# EAGLE design imu (EAGLE 9.5.0)
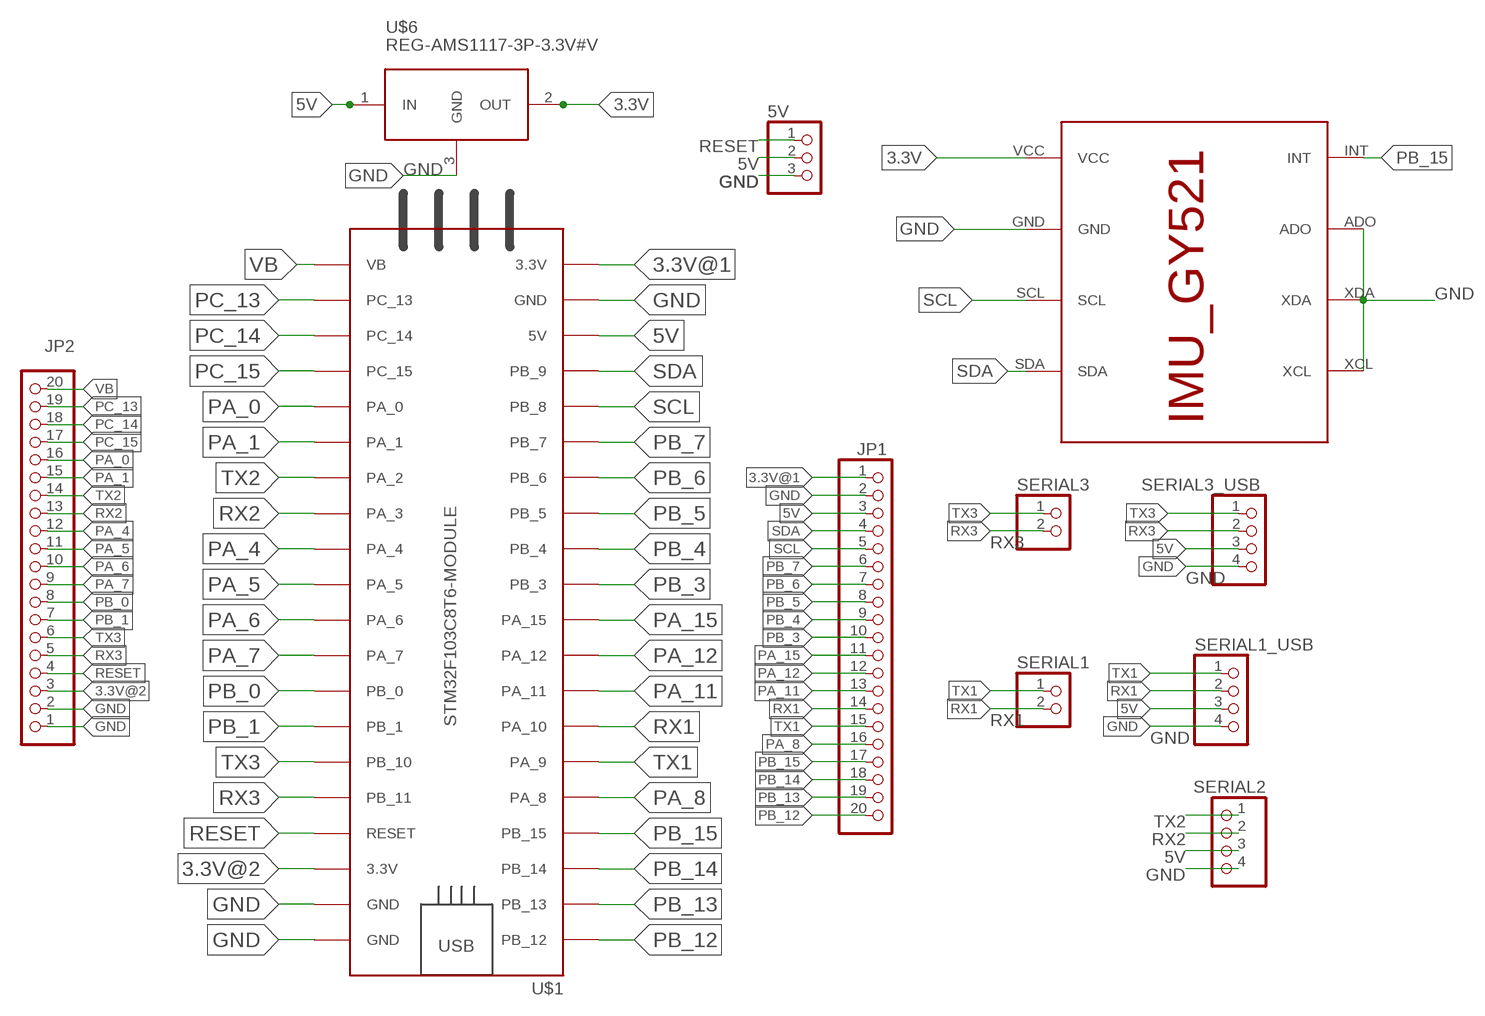
[diagram p0: schematic, sheet 1]

## Parts
5V  PINHD-3_DATA  [1X03_DATA]
JP1  PINHD-1X20  [1X20]
JP2  PINHD-1X20  [1X20]
SERIAL1  PINHD-2_DATA  [1X02_DATA]
SERIAL1_USB  PINHD-4_DATA  [1X04_DATA]
SERIAL2  PINHD-4_DATA  [1X04_DATA]
SERIAL3  PINHD-2_DATA  [1X02_DATA]
SERIAL3_USB  PINHD-4_DATA  [1X04_DATA]
U$1  STM32F103C8T6-MODULE  [STM32F103C8T6-MODULE]
U$2  IMU_ROBOCON_GY521  [IMU_GY521]
U$6  REG-AMS1117-3P-3.3V#V  [REG-AMS1117-3P#V]

## Nets
3.3V: U$2.VCC U$6.2(OUT)
3.3V@1: JP1.1 U$1.3.3V_1(3.3V)
3.3V@2: JP2.3 U$1.3.3V_2(3.3V)
5V: 5V.2 JP1.3 SERIAL1_USB.3 SERIAL2.3 SERIAL3_USB.3 U$1.5V U$6.1(IN)
GND: 5V.3 JP1.2 JP2.1 JP2.2 SERIAL1_USB.4 SERIAL2.4 SERIAL3_USB.4 U$1.GND_1(GND) U$1.GND_2(GND) U$1.GND_3(GND) U$2.ADO U$2.GND U$2.XCL U$2.XDA U$6.3(GND)
PA_0: JP2.16 U$1.PA_0
PA_1: JP2.15 U$1.PA_1
PA_4: JP2.12 U$1.PA_4
PA_5: JP2.11 U$1.PA_5
PA_6: JP2.10 U$1.PA_6
PA_7: JP2.9 U$1.PA_7
PA_8: JP1.16 U$1.PA_8
PA_11: JP1.13 U$1.PA_11
PA_12: JP1.12 U$1.PA_12
PA_15: JP1.11 U$1.PA_15
PB_0: JP2.8 U$1.PB_0
PB_1: JP2.7 U$1.PB_1
PB_3: JP1.10 U$1.PB_3
PB_4: JP1.9 U$1.PB_4
PB_5: JP1.8 U$1.PB_5
PB_6: JP1.7 U$1.PB_6
PB_7: JP1.6 U$1.PB_7
PB_12: JP1.20 U$1.PB_12
PB_13: JP1.19 U$1.PB_13
PB_14: JP1.18 U$1.PB_14
PB_15: JP1.17 U$1.PB_15 U$2.INT
PC_13: JP2.19 U$1.PC_13
PC_14: JP2.18 U$1.PC_14
PC_15: JP2.17 U$1.PC_15
RESET: 5V.1 JP2.4 U$1.RESET
RX1: JP1.14 SERIAL1.2 SERIAL1_USB.2 U$1.PA_10
RX2: JP2.13 SERIAL2.2 U$1.PA_3
RX3: JP2.5 SERIAL3.2 SERIAL3_USB.2 U$1.PB_11
SCL: JP1.5 U$1.PB_8 U$2.SCL
SDA: JP1.4 U$1.PB_9 U$2.SDA
TX1: JP1.15 SERIAL1.1 SERIAL1_USB.1 U$1.PA_9
TX2: JP2.14 SERIAL2.1 U$1.PA_2
TX3: JP2.6 SERIAL3.1 SERIAL3_USB.1 U$1.PB_10
VB: JP2.20 U$1.VB

## Library data of the parts
5V = MIA_LIBRARY-2-2-2:PINHD-3_DATA: PIN HEADER
JP1 JP2 = MIA_LIBRARY-2-2-2:PINHD-1X20: PIN HEADER
SERIAL1 SERIAL3 = MIA_LIBRARY-2-2-2:PINHD-2_DATA: PIN HEADER
SERIAL1_USB SERIAL2 SERIAL3_USB = MIA_LIBRARY-2-2-2:PINHD-4_DATA: PIN HEADER
U$1 = MIA_LIBRARY-2-2-2:STM32F103C8T6-MODULE: STM32F103C8T6 module with ARM Cortex-3, 20kB SRAM, 64kB Flash, 72MHz
U$2 = MIA_LIBRARY-2-2-2:IMU_ROBOCON_GY521
U$6 = MIA_LIBRARY-2-2-2:REG-AMS1117-3P-*: Linear Regulator based on AMS1117 chip 3-pin version AMS1117 datasheet is available here: http://www.advanced-monolithic.com/pdf/ds1117.pdf Click here to find device on ebay.com <http://www.ebay.com/sch/ams1117+module> Note: There are many variants. Search for the proper version.

## Board
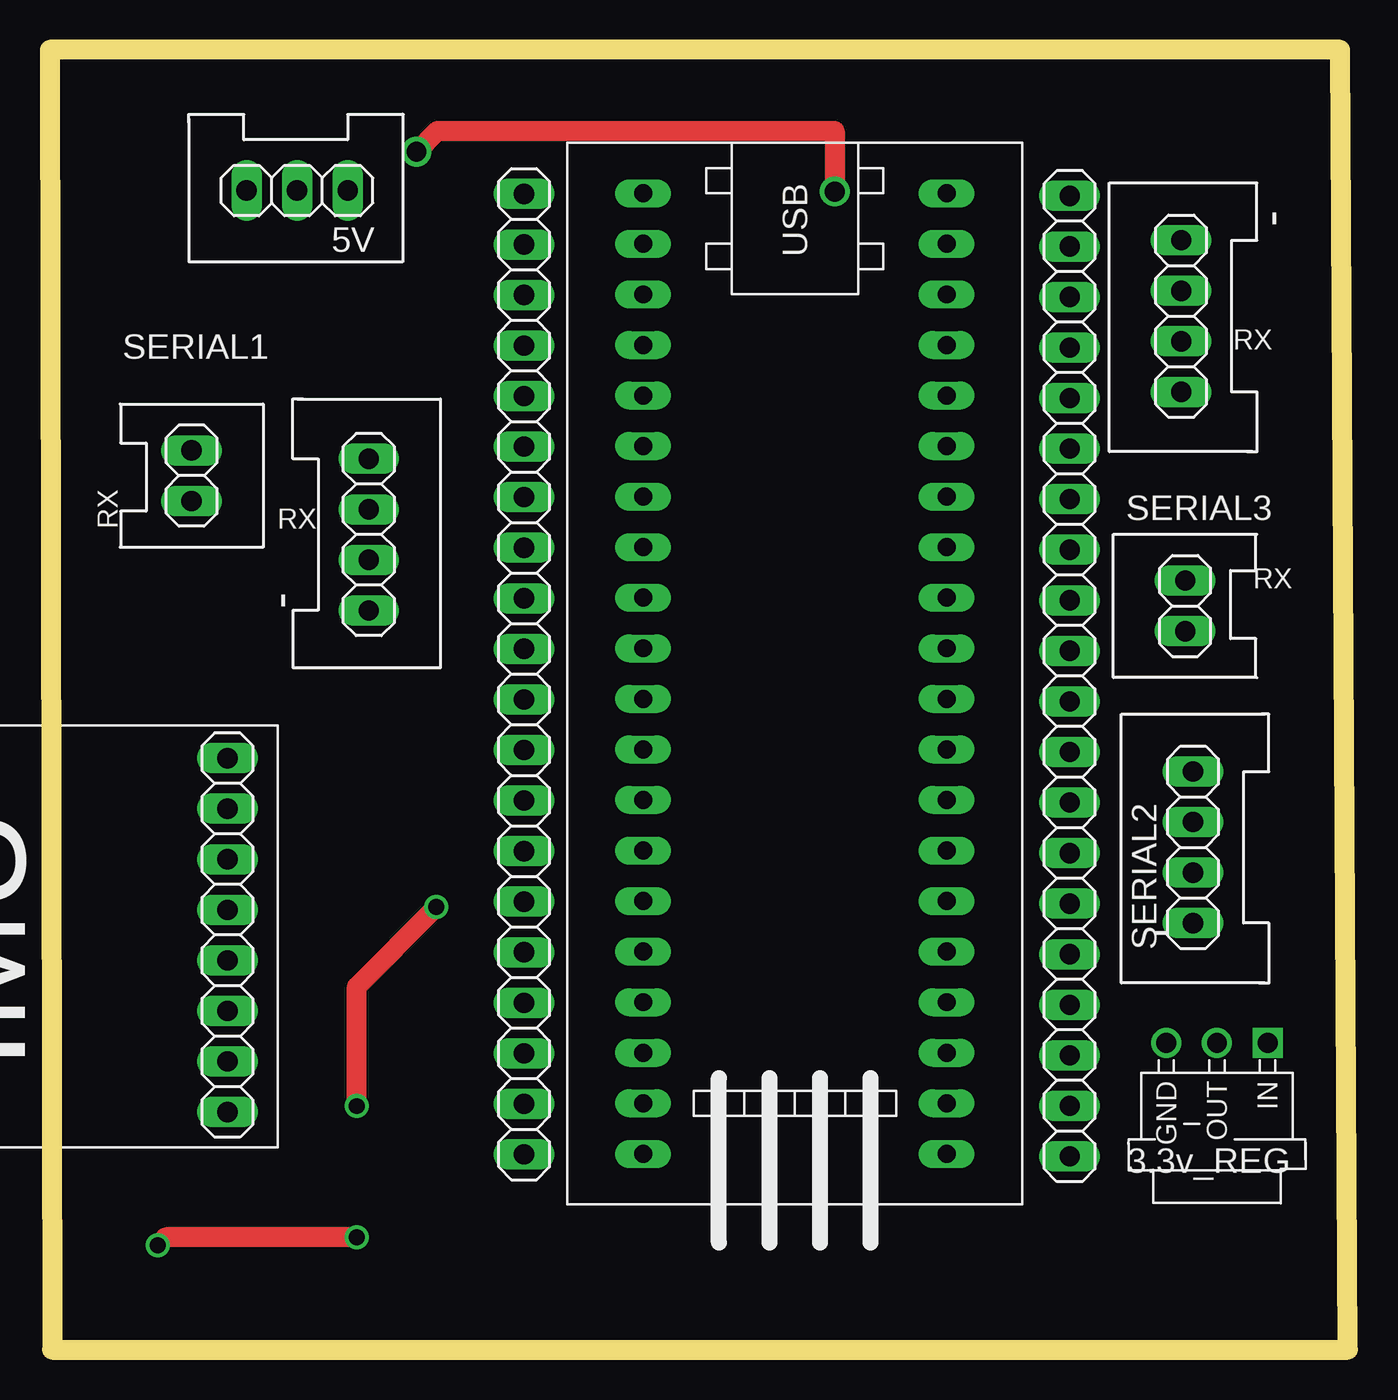
[diagram p1: board, top side]
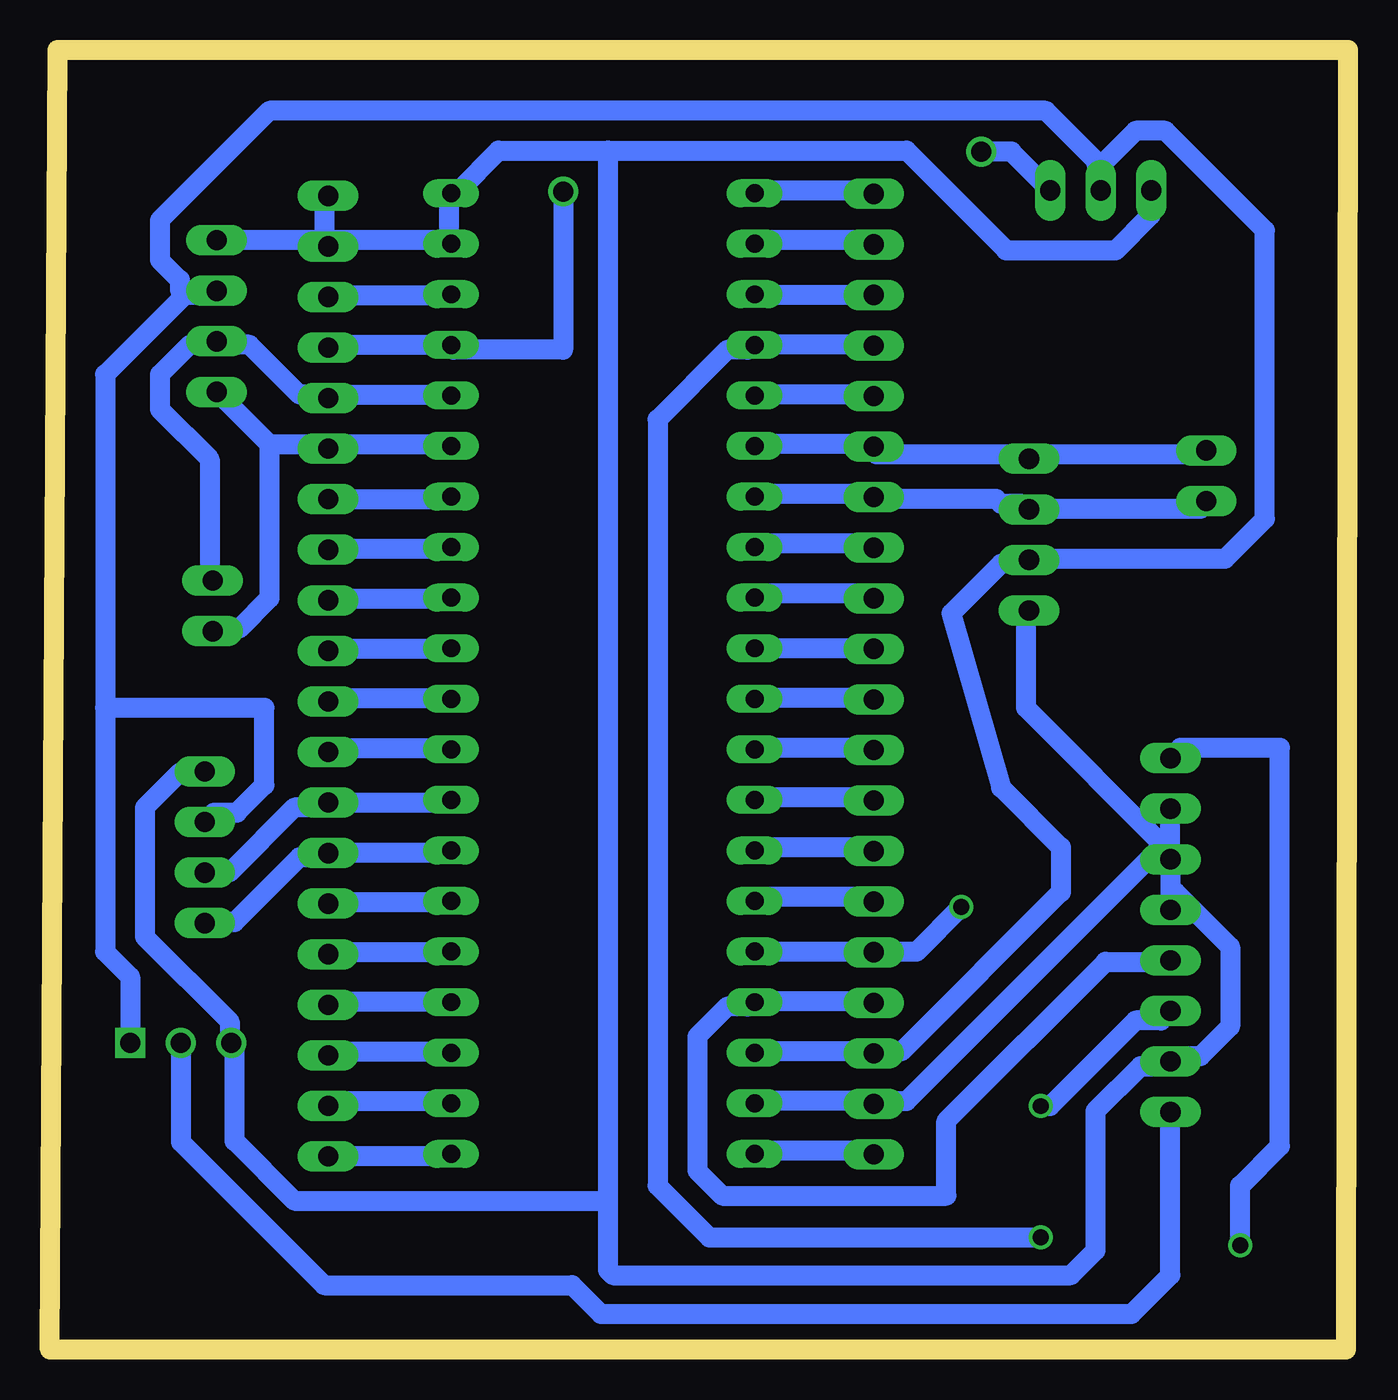
[diagram p2: board, bottom side, seen from below]

Size 65.2 x 65.31 mm. Coordinates in mm from the lower left corner, seen from the top.
Outline: 0.11,0 65.2,0 64.8,65.31 0,65.31 0.11,0
Copper layers (1*16): Top 0.035mm / dielectric 1.5mm / Bottom 0.035mm
Design rules "default *": minimum track width 1mm, minimum drill 0.35mm, track to track 0.8mm, track to pad 0.8mm, pad to pad 0.8mm, via to via 0.8mm, smd to smd 6mil, copper to edge 0.8mm, drill to drill 0.8mm, minimum pad ring 10mil, minimum via ring 8mil, stop-mask expansion 4mil, vias tented up to drill 0mil, thermal gap 10mil

### Footprints (pad centres in the part's own frame; a part is rotated, then mirrored left to right if it is on the bottom)
1X03_DATA = drill 1.016 long: 1 -2.54,0; 2 0,0; 3 2.54,0
1X20 = drill 1.016 long: 1 -24.13,0; 2 -21.59,0; 3 -19.05,0; 4 -16.51,0; 5 -13.97,0; 6 -11.43,0; 7 -8.89,0; 8 -6.35,0; 9 -3.81,0; 10 -1.27,0; 11 1.27,0; 12 3.81,0; 13 6.35,0; 14 8.89,0; 15 11.43,0; 16 13.97,0; 17 16.51,0; 18 19.05,0; 19 21.59,0; 20 24.13,0
1X02_DATA = drill 1.016 long: 1 -1.27,0; 2 1.27,0
1X04_DATA = drill 1.016 long: 1 -3.81,0; 2 -1.27,0; 3 1.27,0; 4 3.81,0
STM32F103C8T6-MODULE = drill 0.9 long: 3.3V_1 25.4,-7.62; 3.3V_2 -17.78,7.62; 5V 20.32,-7.62; GND_1 22.86,-7.62; GND_2 -20.32,7.62; GND_3 -22.86,7.62; PA_0 15.24,7.62; PA_1 12.7,7.62; PA_2 10.16,7.62; PA_3 7.62,7.62; PA_4 5.08,7.62; PA_5 2.54,7.62; PA_6 0,7.62; PA_7 -2.54,7.62; PA_8 -12.7,-7.62; PA_9 -10.16,-7.62; PA_10 -7.62,-7.62; PA_11 -5.08,-7.62; PA_12 -2.54,-7.62; PA_15 0,-7.62; PB_0 -5.08,7.62; PB_1 -7.62,7.62; PB_3 2.54,-7.62; PB_4 5.08,-7.62; PB_5 7.62,-7.62; PB_6 10.16,-7.62; PB_7 12.7,-7.62; PB_8 15.24,-7.62; PB_9 17.78,-7.62; PB_10 -10.16,7.62; PB_11 -12.7,7.62; PB_12 -22.86,-7.62; PB_13 -20.32,-7.62; PB_14 -17.78,-7.62; PB_15 -15.24,-7.62; PC_13 22.86,7.62; PC_14 20.32,7.62; PC_15 17.78,7.62; RESET -15.24,7.62; VB 25.4,7.62
IMU_GY521 = drill 1.016 long: ADO -6.35,0; GND 6.35,0; INT -8.89,0; SCL 3.81,0; SDA 1.27,0; VCC 8.89,0; XCL -3.81,0; XDA -1.27,0
REG-AMS1117-3P#V = drill 1 square: 1 -2.54,-5.08 | drill 1: 2 0,-5.08; 3 2.54,-5.08

### Placement (x,y rotation side)
5V  12.42,58.24 180 top
JP1  23.82,33.94 90 top
JP2  51.22,33.84 270 top
SERIAL1  7.12,43.91 270 top
SERIAL1_USB  16.02,40.95 270 top
SERIAL2  57.42,25.24 90 top
SERIAL3  57.02,37.37 90 top
SERIAL3_USB  56.82,51.93 90 top
U$1  37.42,35.24 270 top
U$2  8.92,20.83 270 top
U$6  58.62,10.34 180 top

### Tracks (layer width: path | path; a pad name or v marks a point on that pad's centre or on a via)
3.3V
  Bottom 1: U$6.2 58.62,10.44 51.42,3.24 38.97,3.24 37.52,1.8 10.86,1.8 8.92,3.74 U$2.VCC
3.3V@1
  Bottom 1: U$1.3.3V_1 29.67,9.99 23.92,9.99 JP1.1
3.3V@2
  Bottom 1: U$1.3.3V_2 45.17,52.99 51.17,52.99 JP2.3
5V
  Bottom 1: 62.42,32.24 62.42,48.99 58.42,52.99 | 62.42,32.24 62.42,19.99 61.17,18.74 61.17,15.49 U$6.1 | 58.42,52.99 56.92,52.99 SERIAL3_USB.3 | U$1.5V 29.67,14.99 23.92,14.99 JP1.3 23.42,14.99 22.42,14.99 14.42,22.99 14.42,25.24 17.42,28.24 19.92,36.99 17.42,39.49 16.42,39.49 SERIAL1_USB.3 15.92,39.74 6.17,39.74 4.17,41.74 4.17,56.24 9.17,61.24 10.67,61.24 12.42,59.49 5V.2 12.67,59.74 15.17,62.24 54.17,62.24 59.67,56.74 59.67,54.74 58.67,53.74 58.67,53.24 58.42,52.99 | SERIAL2.3 56.94,26.99 55.8,26.99 54.42,28.37 54.42,32.24 62.42,32.24
GND
  Bottom 1: SERIAL1_USB.4 16.17,36.99 16.17,32.24 9.17,25.24 U$2.XCL | U$1.GND_1 29.67,12.49 23.92,12.49 JP1.2 23.42,12.49 22.17,12.49 9.42,25.24 U$2.XCL | SERIAL2.4 57.42,28.99 58.67,28.99 60.42,27.24 60.42,20.74 56.17,16.49 56.17,15.49 U$6.3 55.92,14.99 55.92,10.49 52.92,7.49 37.42,7.49 37.17,7.24 | JP2.2 51.42,55.49 51.42,57.74 JP2.1 | SERIAL3_USB.4 51.67,55.74 JP2.2 | 37.17,60.24 42.67,60.24 44.67,58.24 U$1.GND_3 45.17,57.99 45.17,55.74 U$1.GND_2 45.67,55.74 50.92,55.74 JP2.2 | 37.17,60.24 22.17,60.24 17.17,55.24 11.67,55.24 9.92,56.99 9.92,58.24 5V.3 | 37.17,60.24 37.17,7.24 | 37.17,7.24 37.17,3.99 36.92,3.74 13.92,3.74 12.67,4.99 12.67,11.99 10.42,14.24 8.92,14.24 U$2.GND 8.67,14.74 7.42,14.74 5.92,16.24 5.92,20.24 8.67,22.99 8.92,22.99 | U$2.XCL 8.92,22.99 | 8.92,22.99 U$2.XDA | U$2.XCL U$2.ADO
PA_0
  Bottom 1: U$1.PA_0 45.17,19.99 51.17,19.99 JP2.16
PA_1
  Bottom 1: U$1.PA_1 45.17,22.49 51.17,22.49 JP2.15
PA_4
  Bottom 1: U$1.PA_4 45.17,30.24 51.17,30.24 JP2.12
PA_5
  Bottom 1: U$1.PA_5 45.17,32.74 51.17,32.74 JP2.11
PA_6
  Bottom 1: U$1.PA_6 51.17,35.24 JP2.10
PA_7
  Bottom 1: U$1.PA_7 45.17,37.74 51.17,37.74 JP2.9
PA_8
  Bottom 1: U$1.PA_8 29.67,47.99 23.92,47.99 JP1.16
PA_11
  Bottom 1: U$1.PA_11 29.67,40.49 23.92,40.49 JP1.13
PA_12
  Bottom 1: U$1.PA_12 29.67,37.99 23.92,37.99 JP1.12
PA_15
  Bottom 1: U$1.PA_15 23.92,35.24 JP1.11
PB_0
  Bottom 1: U$1.PB_0 45.17,40.24 51.17,40.24 JP2.8
PB_1
  Bottom 1: U$1.PB_1 45.17,42.74 51.17,42.74 JP2.7
PB_3
  Bottom 1: U$1.PB_3 29.67,32.74 23.92,32.74 JP1.10
PB_4
  Bottom 1: U$1.PB_4 29.67,30.24 23.92,30.24 JP1.9
PB_5
  Bottom 1: U$1.PB_5 29.67,27.74 23.92,27.74 JP1.8
PB_6
  Bottom 1: U$1.PB_6 29.67,25.24 23.92,25.24 JP1.7
PB_7
  Bottom 1: U$1.PB_7 29.67,22.74 23.92,22.74 JP1.6
PB_12
  Bottom 1: U$1.PB_12 29.67,58.24 23.92,58.24 JP1.20
PB_13
  Bottom 1: U$1.PB_13 29.67,55.74 23.92,55.74 JP1.19
PB_14
  Bottom 1: JP1.18 29.67,52.99 U$1.PB_14
PB_15  (via drill 0.8)
  Top 1: v15.42,5.64 5.82,5.64 v5.42,5.24
  Bottom 1: JP1.17 23.92,50.49 29.67,50.49 U$1.PB_15 30.17,50.24 31.17,50.24 34.67,46.74 34.67,8.24 32.07,5.64 v15.42,5.64 | v5.42,5.24 5.42,8.24 3.42,10.24 3.42,30.24 8.4,30.24 U$2.INT
PC_13
  Bottom 1: U$1.PC_13 45.17,12.49 51.17,12.49 JP2.19
PC_14
  Bottom 1: U$1.PC_14 45.17,14.99 51.17,14.99 JP2.18
PC_15
  Bottom 1: U$1.PC_15 45.17,17.49 51.17,17.49 JP2.17
RESET  (via drill 1)
  Top 1: v18.42,60.19 19.47,61.24 39.42,61.24 v39.42,58.19
  Bottom 1: 45.17,50.49 51.17,50.49 JP2.4 | 45.17,50.49 U$1.RESET | 5V.1 16.91,60.19 v18.42,60.19 | v39.42,58.19 39.42,50.24 44.92,50.24 45.17,50.49
RX1
  Bottom 1: U$1.PA_10 29.67,42.99 23.92,42.99 JP1.14 23.42,42.74 17.67,42.74 17.42,42.49 16.42,42.49 SERIAL1_USB.2 15.92,42.24 7.42,42.24 7.17,42.49 SERIAL1.2
RX2
  Bottom 1: U$1.PA_3 45.17,27.49 JP2.13 51.67,27.24 52.92,27.24 56.17,23.99 57.42,23.99 SERIAL2.2
RX3
  Bottom 1: U$1.PB_11 45.17,47.99 51.17,47.99 JP2.5 51.67,47.99 52.67,47.99 55.17,50.49 56.67,50.49 SERIAL3_USB.2 57.17,50.49 58.17,50.49 59.67,48.99 59.67,47.24 57.17,44.74 57.17,38.74 SERIAL3.2
SCL  (via drill 0.8)
  Top 1: v15.42,12.24 15.42,18.24 v19.42,22.24
  Bottom 1: 23.92,19.99 29.67,19.99 U$1.PB_8 | 23.92,19.99 JP1.5 | U$2.SCL 9.4,16.54 10.66,16.54 14.97,12.24 v15.42,12.24 | v19.42,22.24 21.67,19.99 23.92,19.99
SDA
  Bottom 1: JP1.4 23.92,17.49 29.67,17.49 U$1.PB_9 30.17,17.24 31.17,17.24 32.67,15.74 32.67,8.99 31.42,7.74 20.17,7.74 20.17,11.49 12.17,19.49 8.92,19.49 U$2.SDA
TX1
  Bottom 1: U$1.PA_9 29.67,45.49 23.92,45.49 JP1.15 23.67,44.99 16.17,44.99 SERIAL1_USB.1 15.67,44.99 7.17,44.99 SERIAL1.1
TX2
  Bottom 1: U$1.PA_2 45.17,24.99 51.17,24.99 JP2.14 51.67,24.74 52.67,24.74 55.92,21.49 57.42,21.49 SERIAL2.1
TX3
  Bottom 1: U$1.PB_10 45.17,45.49 51.17,45.49 JP2.6 51.67,45.49 54.17,45.49 | 54.17,45.49 54.17,37.74 55.67,36.24 56.92,36.24 SERIAL3.1 | 54.17,45.49 56.67,47.99 SERIAL3_USB.1
VB
  Bottom 1: U$1.VB 45.17,9.74 51.17,9.74 JP2.20

### Text on the board
tPlace: 3.3v_REG
tNames: - | RX | RX | RX | RX | - | -